# Altium schematic sheet MCU.SchDoc
size 323 x 209 mm; SheetNumber: 1; SheetTotal: 2
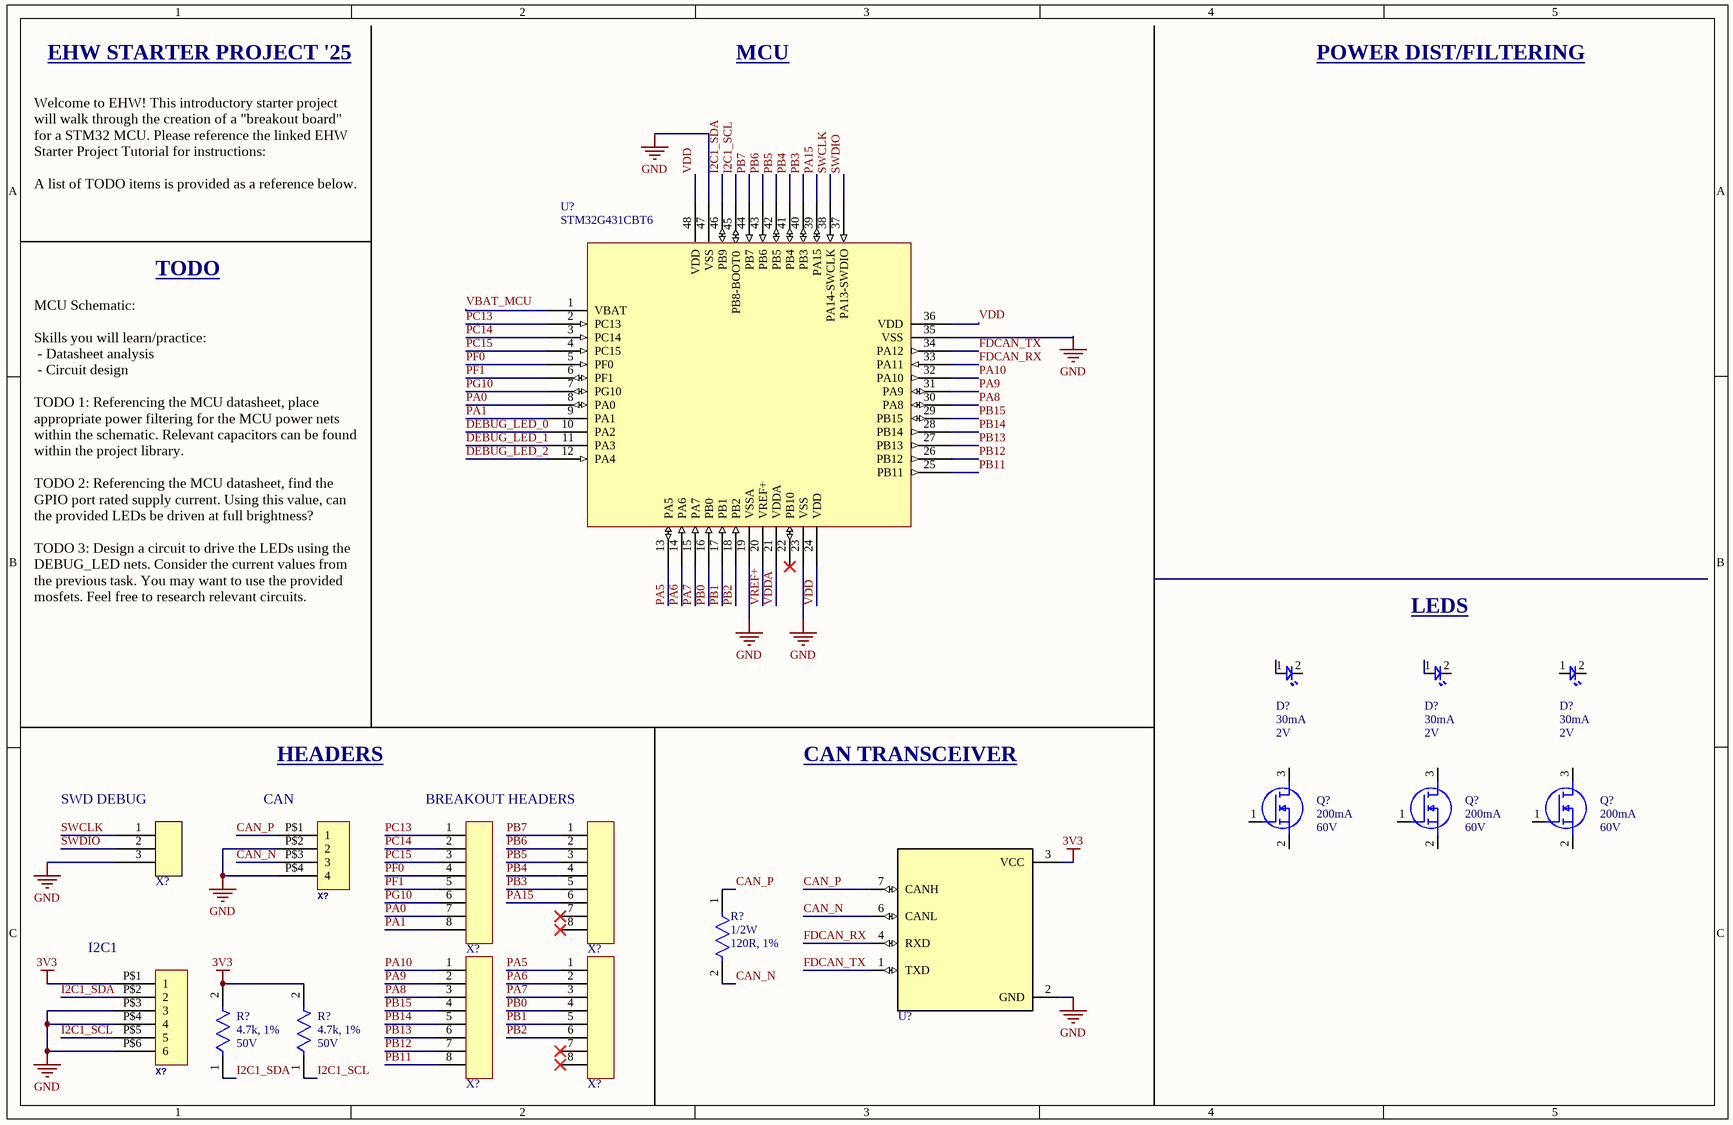
[diagram p0: MCU.SchDoc]

## Parts
(Parts that share a designator on the sheet are numbered #1, #2 ... from top to bottom, then left to right.)
D?#1  Current Rating: 30mA  Vf: 2V  [LED0603-R-RD]  (hidden comment: BL-HKC36G-AV-TRB)
D?#2  Current Rating: 30mA  Vf: 2V  [LED0603-R-RD]  (hidden comment: BL-HKC36G-AV-TRB)
D?#3  Current Rating: 30mA  Vf: 2V  [LED0603-R-RD]  (hidden comment: BL-HKC36G-AV-TRB)
Q?#1  Id-Continuous: 200mA  VDS-Max: 60V  [NMOS-SOT23-3]  (hidden comment: T2N7002AK,LM)
Q?#2  Id-Continuous: 200mA  VDS-Max: 60V  [NMOS-SOT23-3]  (hidden comment: T2N7002AK,LM)
Q?#3  Id-Continuous: 200mA  VDS-Max: 60V  [NMOS-SOT23-3]  (hidden comment: T2N7002AK,LM)
R?#1  Power: 1/2W  Resistance: 120R, 1%  [RESC3126X60X50LL10T20]  (hidden comment: RC1210FR-07120RL)
R?#2  Voltage Rating: 50V  Resistance: 4.7k, 1%  [RESC1608X55X25LL10T15]  (hidden comment: RC0603FR-074K7L)
R?#3  Voltage Rating: 50V  Resistance: 4.7k, 1%  [RESC1608X55X25LL10T15]  (hidden comment: RC0603FR-074K7L)
U?#1  STM32G431CBT6  [Quad48]
U?#2  TCAN332GDR  [SOIC127P599X175-8N]  (value not drawn)
X?#1  61300811121  [61300811121]  (value not drawn)
X?#2  61300811121  [61300811121]  (value not drawn)
X?#3  Molex 43650-0415  [43650-0415]  (value not drawn)
X?#4  61300311121  [61300311121]  (value not drawn)
X?#5  61300811121  [61300811121]  (value not drawn)
X?#6  61300811121  [61300811121]  (value not drawn)
X?#7  Molex 43045-0612  [43045-0612]  (value not drawn)

## Nets
3V3: R?#2.2 R?#3.2 U?#2.3(VCC) X?#7.P$1(1)
GND: U?#1.19(VSSA) U?#1.23(VSS) U?#1.35(VSS) U?#1.47(VSS) U?#2.2(GND) X?#3.P$2(2) X?#3.P$4(4) X?#4.3 X?#7.P$3(3) X?#7.P$4(4) X?#7.P$6(6)
CAN_N: R?#1.2 U?#2.6(CANL) X?#3.P$3(3)
CAN_P: R?#1.1 U?#2.7(CANH) X?#3.P$1(1)
DEBUG_LED_0: U?#1.10(PA2)
DEBUG_LED_1: U?#1.11(PA3)
DEBUG_LED_2: U?#1.12(PA4)
FDCAN_RX: U?#1.33(PA11) U?#2.4(RXD)
FDCAN_TX: U?#1.34(PA12) U?#2.1(TXD)
I2C1_SCL: R?#3.1 U?#1.45(PB8-BOOT0) X?#7.P$5(5)
I2C1_SDA: R?#2.1 U?#1.46(PB9) X?#7.P$2(2)
PA0: U?#1.8(PA0) X?#1.7
PA1: U?#1.9(PA1) X?#1.8
PA5: U?#1.13(PA5) X?#6.1
PA6: U?#1.14(PA6) X?#6.2
PA7: U?#1.15(PA7) X?#6.3
PA8: U?#1.30(PA8) X?#5.3
PA9: U?#1.31(PA9) X?#5.2
PA10: U?#1.32(PA10) X?#5.1
PA15: U?#1.39(PA15) X?#2.6
PB0: U?#1.16(PB0) X?#6.4
PB1: U?#1.17(PB1) X?#6.5
PB2: U?#1.18(PB2) X?#6.6
PB3: U?#1.40(PB3) X?#2.5
PB4: U?#1.41(PB4) X?#2.4
PB5: U?#1.42(PB5) X?#2.3
PB6: U?#1.43(PB6) X?#2.2
PB7: U?#1.44(PB7) X?#2.1
PB11: U?#1.25(PB11) X?#5.8
PB12: U?#1.26(PB12) X?#5.7
PB13: U?#1.27(PB13) X?#5.6
PB14: U?#1.28(PB14) X?#5.5
PB15: U?#1.29(PB15) X?#5.4
PC13: U?#1.2(PC13) X?#1.1
PC14: U?#1.3(PC14) X?#1.2
PC15: U?#1.4(PC15) X?#1.3
PF0: U?#1.5(PF0) X?#1.4
PF1: U?#1.6(PF1) X?#1.5
PG10: U?#1.7(PG10) X?#1.6
SWCLK: U?#1.38(PA14-SWCLK) X?#4.1
SWDIO: U?#1.37(PA13-SWDIO) X?#4.2
VBAT_MCU: U?#1.1(VBAT)
VDD: U?#1.24(VDD) U?#1.36(VDD) U?#1.48(VDD)
VDDA: U?#1.21(VDDA)
VREF+: U?#1.20(VREF+)

Not connected (* = marked no-connect by the designer): D?#1 1 2; D?#2 1 2; D?#3 1 2; Q?#1 1(G) 2(S) 3(D); Q?#2 1(G) 2(S) 3(D); Q?#3 1(G) 2(S) 3(D); U?#1 22(PB10)*; X?#2 7* 8*; X?#6 7* 8*

## Notes on the sheet
- EHW STARTER PROJECT '25
- MCU
- POWER DIST/FILTERING
- Welcome to EHW! This introductory starter project will walk through the creation of a "breakout board" for a STM32 MCU. Please reference the linked EHW Starter Project Tutorial for instructions:
  A list of TODO items is provided as a reference below.
- TODO
- MCU Schematic:
  Skills you will learn/practice:
  - Datasheet analysis
  - Circuit design
  TODO 1: Referencing the MCU datasheet, place appropriate power filtering for the MCU power nets within the schematic. Relevant capacitors can be found within the project library.
  TODO 2: Referencing the MCU datasheet, find the GPIO port rated supply current. Using this value, can the provided LEDs be driven at full brightness?
  TODO 3: Design a circuit to drive the LEDs using the DEBUG_LED nets. Consider the current values from the previous task. You may want to use the provided mosfets. Feel free to research relevant circuits.
- LEDS
- (near X?#4) SWD DEBUG
- (near X?#3) CAN
- HEADERS
- (near X?#1) BREAKOUT HEADERS
- CAN TRANSCEIVER
- (near X?#7) I2C1

## Library data of the parts
D?#1-D?#3 = LED-0001: LED YELLOW CLEAR 0603 SMD
Q?#1-Q?#3 = NMOS-200MA-0001: MOSFET N-CH 60V 200MA SOT23; Manufacturer: Toshiba; FET type: N-Channel; Rds On-Max: 3.9Ohm; Vgs-Max: 20V; Assembled?: no; Manufacturer Part Number: T2N7002AK,LM; Package: SOT-23-3
R?#1 = RES-120-0001: 120 Ohms ±1% 0.5W, 1/2W Chip Resistor 1210 (3225 Metric) Moisture Resistant Thick Film; Manufacturer: Yageo; Part Number: RC1210FR-07120RL
R?#2 R?#3 = RES-4.7k-0001: Chip Resistor, 4.7 KOhm, +/- 1%, 0.1 W, -55 to 155 degC, 0603 (1608 Metric), RoHS, Tape and Reel; Manufacturer: Yageo; Power Rating: 100mW; Temperature Coefficient: 100PPM/C; Package Reference: 0603; Series: RC; Datasheet Version: Rev. 7, 05/2017; Packaging: Reel; Termination Style: SMD/SMT; Datasheet URL: http://www.yageo.com/documents/recent/PYu-RC_Group_51_RoHS_L_7.pdf; Manufacturer URL: http://www.yageo.com/; Package Description: 2-Pin Surface Mount Device, Body 1.6 x 0.8 mm; Case Code - mm: 1608; Case Code - in: 0603; Mounting Technology: SurfaceMount; Operating Temperature Range: -55Cto+155C; Tolerance: 1%; Product: ThickFilmResistorsGeneralPurpose
U?#1 = IC-STM32G431CBT6: ARM® Cortex®-M4F STM32G4 Microcontroller IC 32-Bit Single-Core 170MHz 128KB (128K x 8) FLASH 48-LQFP (7x7); Parameter 1: *
U?#2 = IC-CAN-0001: 3.3-V CAN Transceivers with CAN FD (Flexible Data Rate); MF: Texas Instruments; Purchase-URL: https://pricing.snapeda.com/search?q=TCAN332GDR&ref=eda; Package: SOIC-8 Texas Instruments; Check_prices: https://www.snapeda.com/parts/TCAN332GDR/Texas+Instruments/view-part/?ref=eda; Value: *; SnapEDA_Link: https://www.snapeda.com/parts/TCAN332GDR/Texas+Instruments/view-part/?ref=snap; MP: TCAN332GDR; Digi-Key_Part_Number: 296-48678-2-ND
X?#1 X?#2 X?#5 X?#6 = CONN-8POS-0001: CONN HEADER VERT 8POS 2.54MM; NexarPartId: 32855533; Connector Type: Male Pin; Number of Contacts: 8; Voltage Rating: 250V; Current Rating: 3A; Contact Resistance: 20mΩ; Gender: Male; Termination: Solder; Contact Material: Copper; Mount: Through Hole; Lead Pitch: 2.54mm; Number of Positions: 8; Operating Supply Voltage: 250V; Number of Pins: 8; Max Operating Temperature: 105°C; Height: 8.54mm; Pitch: 2.54mm; REACH SVHC: Unknown; Number of Rows: 1; Packaging: Bulk; Contact Plating: Gold; Contact Mating Length: 5.9944mm; Orientation: Vertical; RoHS: Compliant; Color: Black; Min Operating Temperature: -40°C
X?#3 = CONN-4POS-0001: GateName_1: G$1; SymbolName_1: HEADER_POS4; DeviceSetName: HEADER_POS4_?; DeviceName: 43650-0415; LibraryName: con-molex-micro-fit-3_0_2; Package: 43650-0415
X?#4 = CONN-3POS-0001: Connector Header Through Hole 3 position 0.100" (2.54mm); NexarPartId: 32855521; Current Rating: 3A; Voltage Rating: 250V; Number of Positions: 3; Contact Resistance: 20mΩ; Connector Type: Male Pin; Gender: Male; REACH SVHC: Unknown; Packaging: Bulk; Contact Material: Copper; Pitch: 2.54mm; Min Operating Temperature: -40°C; Number of Rows: 1; Orientation: Vertical; RoHS: Compliant; Contact Plating: Gold; Max Operating Temperature: 105°C; Mount: Through Hole; Height: 8.94mm; Operating Supply Voltage: 250V; Number of Pins: 3; Contact Mating Length: 5.9944mm; Number of Contacts: 3; Color: Black; Lead Free: Lead Free; Lead Pitch: 2.54mm; Termination: Solder
X?#7 = CONN-6POS-0001: GateName_1: G$1; SymbolName_1: HEADER_POS6; DeviceSetName: HEADER_POS6_?; DeviceName: 43045-0612; LibraryName: con-molex-micro-fit-3_0_2; Package: 43045-0612